# EAGLE schematic test (EAGLE 6.5.0)
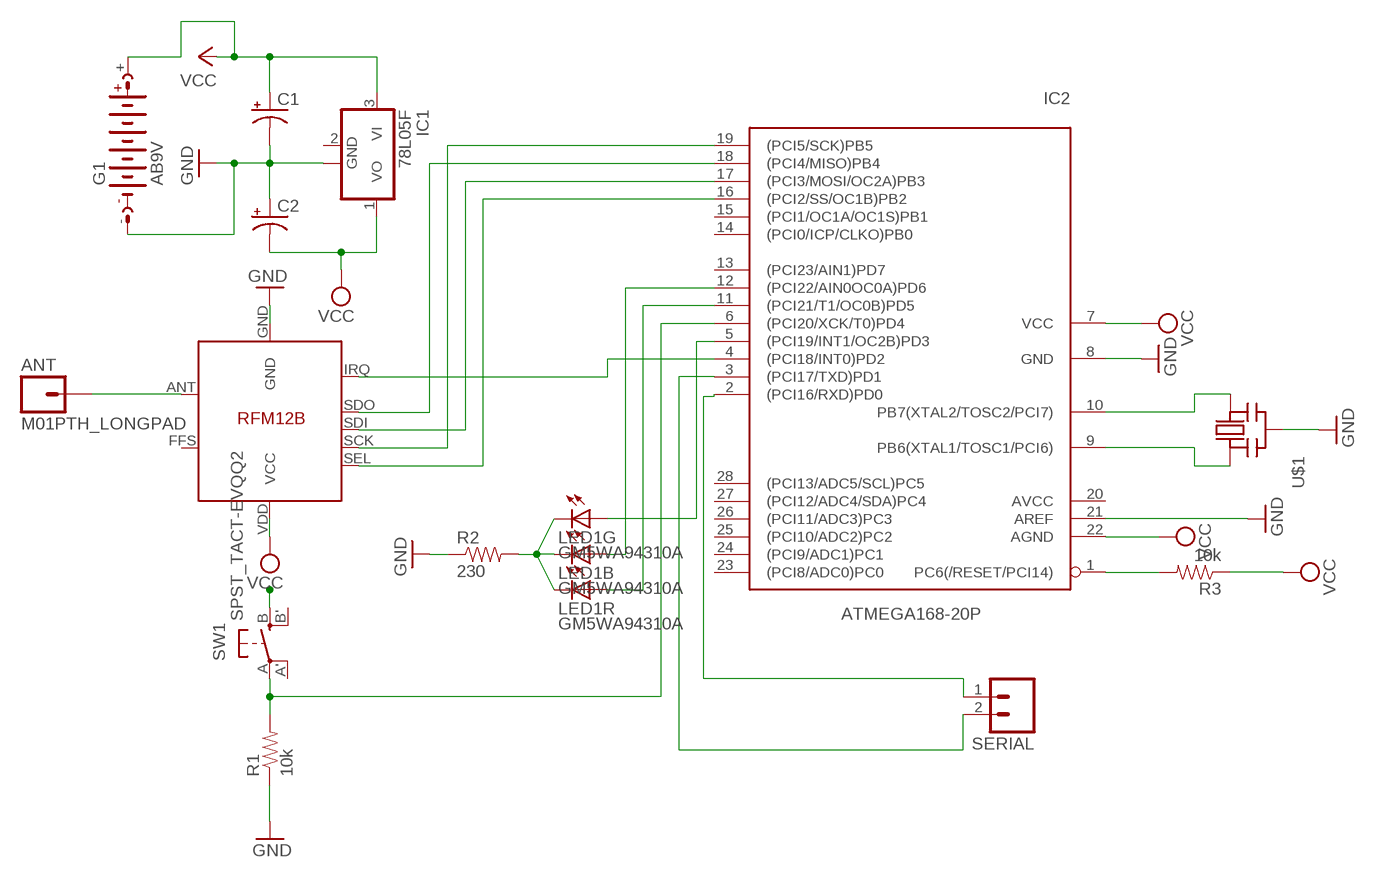
[diagram p0: schematic, sheet 1]

## Parts
ANT  M01PTH_LONGPAD  [1X01_LONGPAD]
C1  CAP_POLC  [PANASONIC_C]
C2  CAP_POLC  [PANASONIC_C]
G1  AB9V  [AB9V]
IC1  78L05F  [SOT89]
IC2  ATMEGA168-20P  [DIL28-3]
LED1  GM5WA94310A  [GM5WA94310A]
R1  10k  RESISTOR2512  [R2512]
R2  230  RESISTOR2512  [R2512]
R3  10k  RESISTOR2512  [R2512]
SERIAL  M02LOCK_LONGPADS  [1X02_LOCK_LONGPADS]
SW1  SPST_TACT-EVQQ2  [EVQ-Q2]
U$1  CERMOSCILL-CSTCRG  [CSTCR-G]
U$3  RFM12B  [RFM12B]

## Nets
5V: C2.- IC1.1(VO) IC2.7(VCC) R3.1 SW1.B(S) U$3.VDD(VCC) ; supply symbol labelled VCC
GND: C1.- C2.+ G1.- IC1.2@1(GND) IC2.8(GND) IC2.21(AREF) R1.1 R2.1 U$1.2(GND) U$3.GND
N$1: LED1.4(G:C) LED1.5(R:C) LED1.6(B:C) R2.2
N$2: IC2.9(PB6(XTAL1/TOSC1/PCI6)) U$1.1(IN)
N$3: IC2.4((PCI18/INT0)PD2) U$3.IRQ
N$4: IC2.16((PCI2/SS/OC1B)PB2) U$3.SEL
N$5: IC2.19((PCI5/SCK)PB5) U$3.SCK
N$6: IC2.17((PCI3/MOSI/OC2A)PB3) U$3.SDI
N$7: IC2.3((PCI17/TXD)PD1) SERIAL.2
N$8: IC2.11((PCI21/T1/OC0B)PD5) LED1.2(R:A)
N$9: IC2.5((PCI19/INT1/OC2B)PD3) LED1.3(G:A)
N$11: IC2.2((PCI16/RXD)PD0) SERIAL.1
N$12: IC2.12((PCI22/AIN0OC0A)PD6) LED1.1(B:A)
N$13: IC2.10(PB7(XTAL2/TOSC2/PCI7)) U$1.3(OUT)
N$14: IC2.18((PCI4/MISO)PB4) U$3.SDO
N$15: IC2.6((PCI20/XCK/T0)PD4) R1.2 SW1.A(P)
N$16: ANT.1 U$3.ANT
N$30: IC2.1(PC6(/RESET/PCI14)) R3.2
VCCBAT: C1.+ G1.+ IC1.3(VI) ; supply symbol labelled VCC
Unconnected: IC1.2(GND) IC2.13((PCI23/AIN1)PD7) IC2.14((PCI0/ICP/CLKO)PB0) IC2.15((PCI1/OC1A/OC1S)PB1) IC2.20(AVCC) IC2.22(AGND) IC2.23((PCI8/ADC0)PC0) IC2.24((PCI9/ADC1)PC1) IC2.25((PCI10/ADC2)PC2) IC2.26((PCI11/ADC3)PC3) IC2.27((PCI12/ADC4/SDA)PC4) IC2.28((PCI13/ADC5/SCL)PC5) SW1.A'(P1) SW1.B'(S1) U$3.FFS

## Library data of the parts
ANT = SparkFun:M01: Header 1 Standard 1-pin 0.1" header. Use with straight break away headers (SKU : PRT-00116), right angle break away headers (PRT-00553), swiss pins (PRT-00743), machine pins (PRT-00117), and female headers (PRT-00115).
C1 C2 = SparkFun:CAP_POL: Capacitor Polarized These are standard SMD and PTH capacitors. Normally 10uF, 47uF, and 100uF in electrolytic and tantalum varieties. Always verify the external diameter of the through hole cap, it varies with capacity, voltage, and manufacturer. The EIA devices should be standard.
G1 = battery:AB9V: 9-V BATTERY CLIP
IC1 = linear:78L*: POSITOIV-VOLTAGE REGULATORS Output up to 100 mA Source: http://focus.ti.com/lit/ds/symlink/ua78l05.pdf
IC2 = adafruit:ATMEGA168*P: MICROCONTROLLER 16 kBytes FLASH 1 kBytes SRAM 512 Bytes EEPROM USART 8-channel 10 bit ADC
LED1 = led:GM5WA94310A: Chip LED RGB Source: http://document.sharpsma.com/files/GM5WA94310A_SS.pdf
R1-R3 = SparkFun:RESISTOR: Resistor Basic schematic elements and footprints for 0603, 1206, and PTH resistors.
SERIAL = SparkFun:M02: Header 2 Standard 2-pin 0.1" header. Use with straight break away headers (SKU : PRT-00116), right angle break away headers (PRT-00553), swiss pins (PRT-00743), machine pins (PRT-00117), and female headers (PRT-00115). Molex polarized connector foot print use with SKU : PRT-08233 with associated crimp pins and housings.
SW1 = adafruit:SPST_TACT: SMT 6mm switch, EVQQ2 series http://www.ladyada.net/library/eagle
U$1 = adafruit:CERMOSCILL: Ceramic oscillator with built in capacitors such as ZTT-12MHz http://www.ladyada.net/library/eagle
U$3 = JeeParts:RFM12B